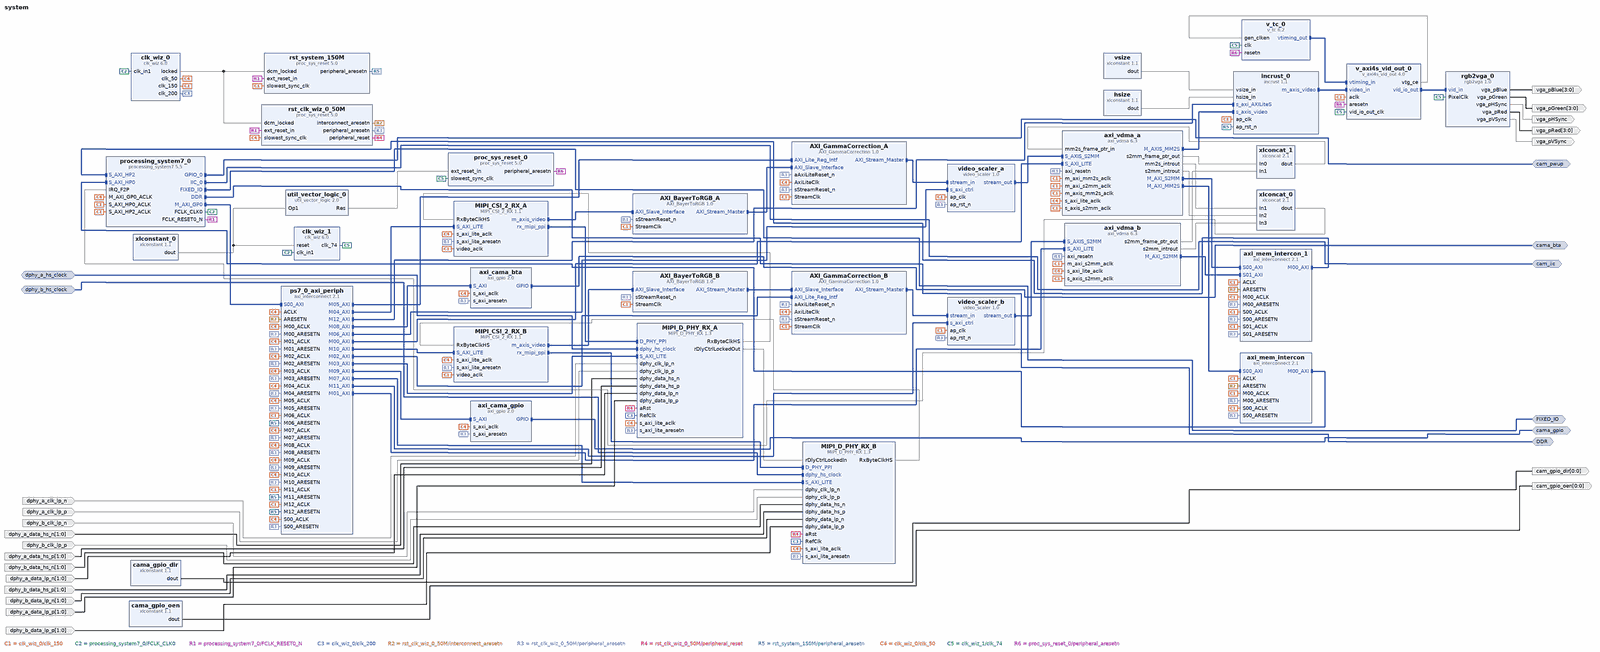
[diagram p0: block diagram of the top level, whole]
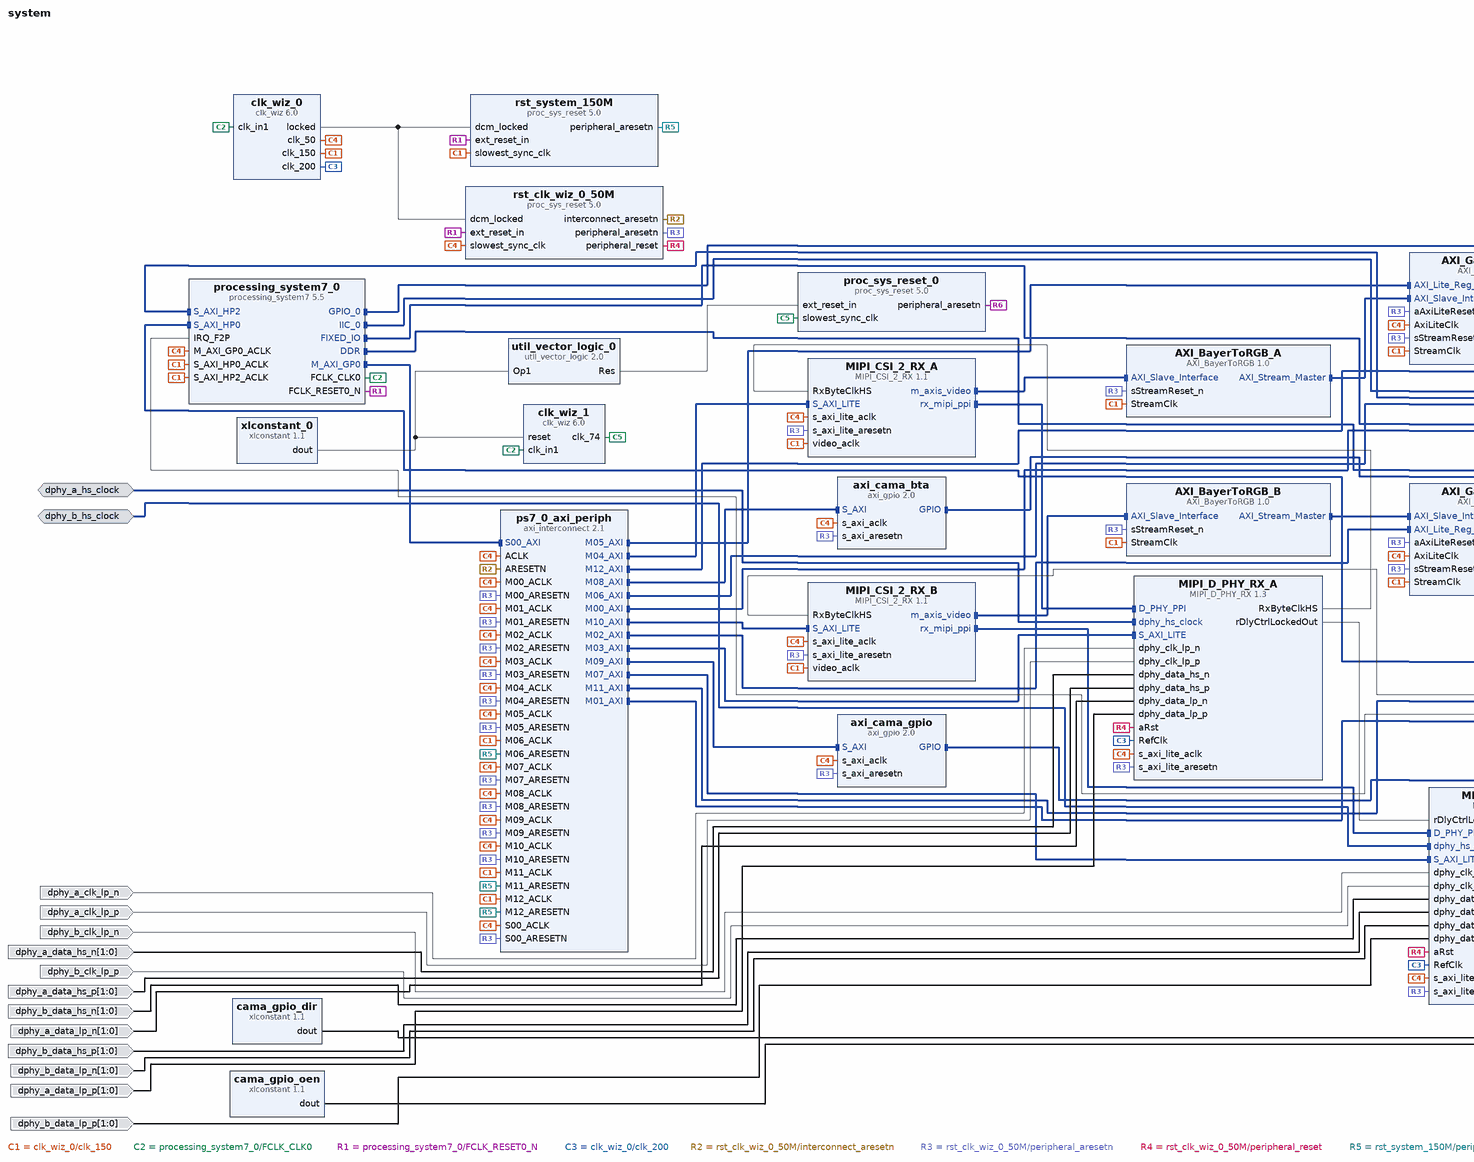
[diagram p1: block diagram of the top level, left part]
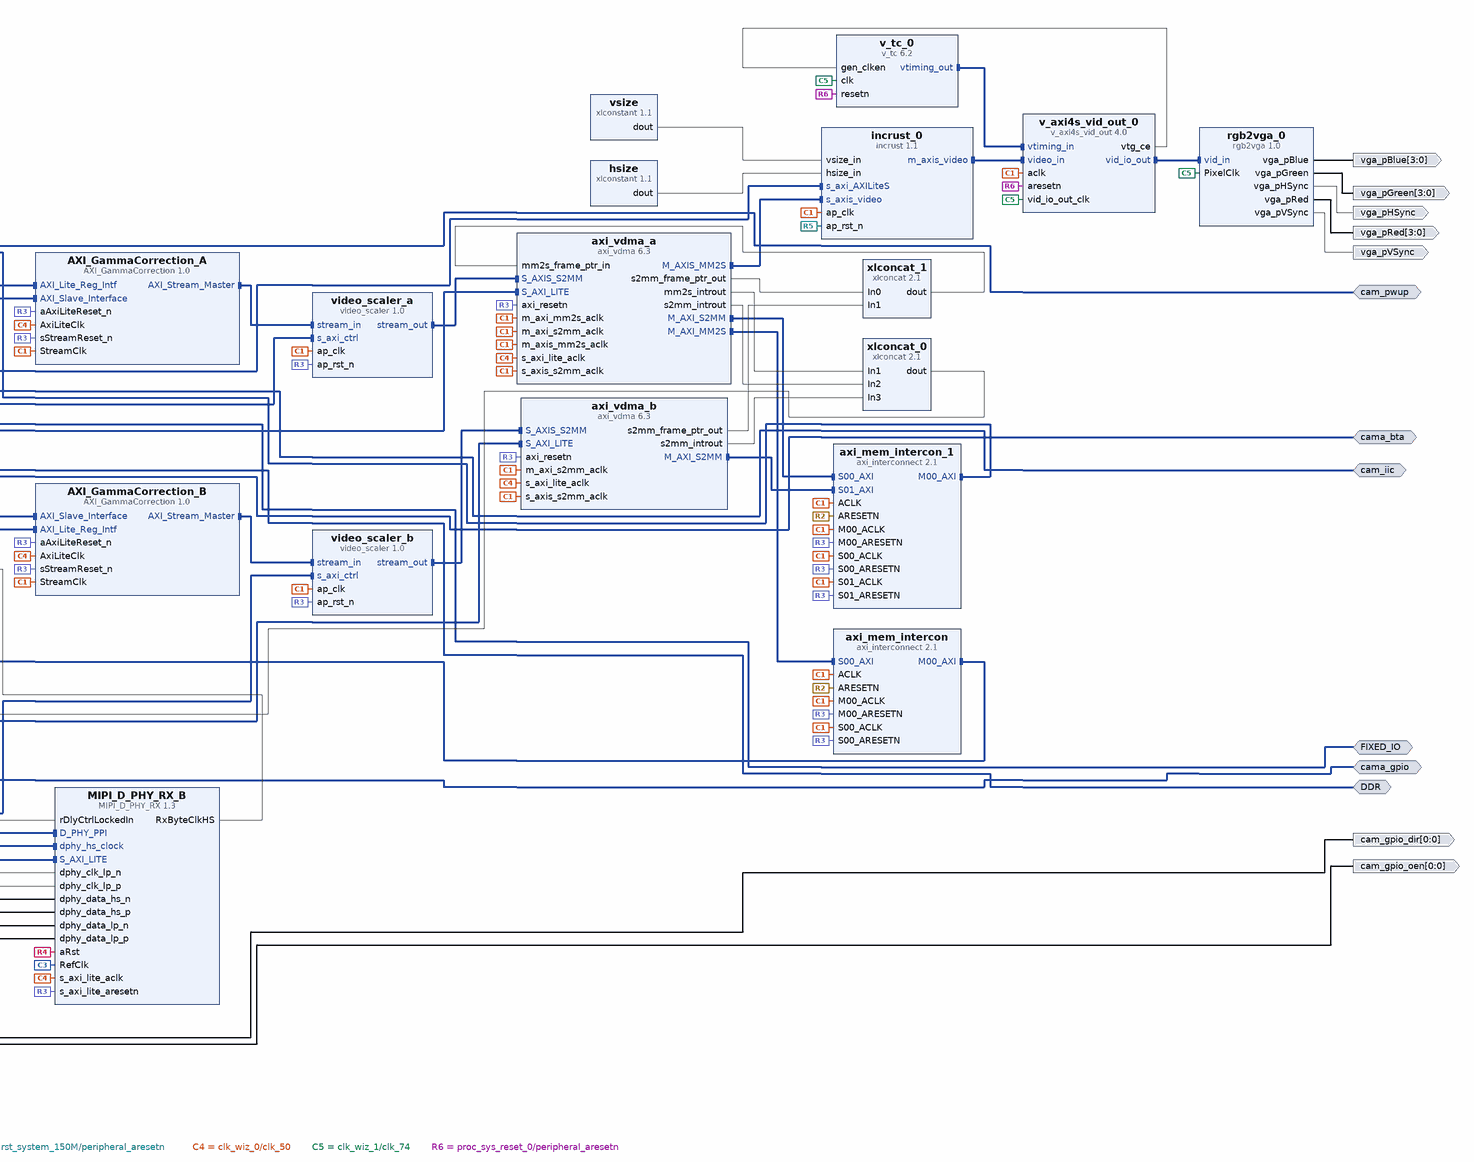
[diagram p2: block diagram of the top level, right part]
# Vivado block design system, xc7z020clg484-1, Vivado 2019.2
create_bd_design system

create_bd_intf_port -mode Master -vlnv xilinx.com:interface:ddrx_rtl:1.0 DDR
create_bd_intf_port -mode Master -vlnv xilinx.com:display_processing_system7:fixedio_rtl:1.0 FIXED_IO
create_bd_intf_port -mode Master -vlnv xilinx.com:interface:iic_rtl:1.0 cam_iic
create_bd_intf_port -mode Master -vlnv xilinx.com:interface:gpio_rtl:1.0 cam_pwup
create_bd_intf_port -mode Master -vlnv xilinx.com:interface:gpio_rtl:1.0 cama_bta
create_bd_intf_port -mode Master -vlnv xilinx.com:interface:gpio_rtl:1.0 cama_gpio
create_bd_intf_port -mode Slave -vlnv xilinx.com:interface:diff_clock_rtl:1.0 dphy_a_hs_clock
set_property -dict {CONFIG.FREQ_HZ 336000000} [get_bd_intf_ports dphy_a_hs_clock]
create_bd_intf_port -mode Slave -vlnv xilinx.com:interface:diff_clock_rtl:1.0 dphy_b_hs_clock
create_bd_port -dir O -from 0 -to 0 cam_gpio_dir
create_bd_port -dir O -from 0 -to 0 cam_gpio_oen
create_bd_port -dir I dphy_b_clk_lp_n
create_bd_port -dir I dphy_a_clk_lp_n
create_bd_port -dir I dphy_b_clk_lp_p
create_bd_port -dir I dphy_a_clk_lp_p
create_bd_port -dir I -from 1 -to 0 dphy_b_data_hs_n
create_bd_port -dir I -from 1 -to 0 dphy_a_data_hs_n
create_bd_port -dir I -from 1 -to 0 dphy_b_data_hs_p
create_bd_port -dir I -from 1 -to 0 dphy_a_data_hs_p
create_bd_port -dir I -from 1 -to 0 dphy_b_data_lp_n
create_bd_port -dir I -from 1 -to 0 dphy_a_data_lp_n
create_bd_port -dir I -from 1 -to 0 dphy_b_data_lp_p
create_bd_port -dir I -from 1 -to 0 dphy_a_data_lp_p
create_bd_port -dir O -from 3 -to 0 vga_pBlue
create_bd_port -dir O -from 3 -to 0 vga_pGreen
create_bd_port -dir O vga_pHSync
create_bd_port -dir O -from 3 -to 0 vga_pRed
create_bd_port -dir O vga_pVSync

create_bd_cell -type ip -vlnv digilentinc.com:user:AXI_BayerToRGB:1.0 AXI_BayerToRGB_A
create_bd_cell -type ip -vlnv digilentinc.com:user:AXI_BayerToRGB:1.0 AXI_BayerToRGB_B
create_bd_cell -type ip -vlnv digilentinc.com:user:AXI_GammaCorrection:1.0 AXI_GammaCorrection_A
create_bd_cell -type ip -vlnv digilentinc.com:user:AXI_GammaCorrection:1.0 AXI_GammaCorrection_B
create_bd_cell -type ip -vlnv xilinx.com:ip:processing_system7:5.5 processing_system7_0
set_property -dict [list \
  CONFIG.PCW_APU_PERIPHERAL_FREQMHZ 666.666667 \
  CONFIG.PCW_ENET0_ENET0_IO {MIO 16 .. 27} \
  CONFIG.PCW_ENET0_GRP_MDIO_ENABLE 1 \
  CONFIG.PCW_ENET0_GRP_MDIO_IO {MIO 52 .. 53} \
  CONFIG.PCW_ENET0_PERIPHERAL_ENABLE 1 \
  CONFIG.PCW_ENET_RESET_ENABLE 0 \
  CONFIG.PCW_FPGA0_PERIPHERAL_FREQMHZ 100.000000 \
  CONFIG.PCW_FPGA1_PERIPHERAL_FREQMHZ 150.000000 \
  CONFIG.PCW_GPIO_EMIO_GPIO_ENABLE 1 \
  CONFIG.PCW_GPIO_EMIO_GPIO_IO 2 \
  CONFIG.PCW_GPIO_EMIO_GPIO_WIDTH 2 \
  CONFIG.PCW_GPIO_MIO_GPIO_ENABLE 1 \
  CONFIG.PCW_GPIO_MIO_GPIO_IO MIO \
  CONFIG.PCW_I2C0_I2C0_IO EMIO \
  CONFIG.PCW_I2C0_PERIPHERAL_ENABLE 1 \
  CONFIG.PCW_I2C_PERIPHERAL_FREQMHZ 111.111115 \
  CONFIG.PCW_I2C_RESET_ENABLE 0 \
  CONFIG.PCW_IRQ_F2P_INTR 1 \
  CONFIG.PCW_PERIPHERAL_BOARD_PRESET part0 \
  CONFIG.PCW_PRESET_BANK1_VOLTAGE {LVCMOS 1.8V} \
  CONFIG.PCW_QSPI_GRP_SINGLE_SS_ENABLE 1 \
  CONFIG.PCW_QSPI_GRP_SINGLE_SS_IO {MIO 1 .. 6} \
  CONFIG.PCW_QSPI_PERIPHERAL_ENABLE 1 \
  CONFIG.PCW_QSPI_QSPI_IO {MIO 1 .. 6} \
  CONFIG.PCW_SD0_GRP_CD_ENABLE 1 \
  CONFIG.PCW_SD0_GRP_CD_IO {MIO 47} \
  CONFIG.PCW_SD0_GRP_WP_ENABLE 1 \
  CONFIG.PCW_SD0_GRP_WP_IO {MIO 46} \
  CONFIG.PCW_SD0_PERIPHERAL_ENABLE 1 \
  CONFIG.PCW_SD0_SD0_IO {MIO 40 .. 45} \
  CONFIG.PCW_SDIO_PERIPHERAL_FREQMHZ 100 \
  CONFIG.PCW_SINGLE_QSPI_DATA_MODE x4 \
  CONFIG.PCW_UART1_PERIPHERAL_ENABLE 1 \
  CONFIG.PCW_UART1_UART1_IO {MIO 48 .. 49} \
  CONFIG.PCW_UART_PERIPHERAL_FREQMHZ 50 \
  CONFIG.PCW_UIPARAM_DDR_FREQ_MHZ 533.333313 \
  CONFIG.PCW_UIPARAM_DDR_PARTNO {MT41J128M16 HA-15E} \
  CONFIG.PCW_USB0_PERIPHERAL_ENABLE 1 \
  CONFIG.PCW_USB0_RESET_ENABLE 0 \
  CONFIG.PCW_USB0_USB0_IO {MIO 28 .. 39} \
  CONFIG.PCW_USB_RESET_ENABLE 1 \
  CONFIG.PCW_USB_RESET_SELECT {Share reset pin} \
  CONFIG.PCW_USE_FABRIC_INTERRUPT 1 \
  CONFIG.PCW_USE_S_AXI_HP0 1 \
  CONFIG.PCW_USE_S_AXI_HP2 1 \
  CONFIG.preset ZedBoard \
] [get_bd_cells processing_system7_0]
# 516 more settings of processing_system7_0 are not shown: defaults, MIO pin electricals, DDR timing, and values the tool derives
create_bd_cell -type ip -vlnv digilentinc.com:ip:rgb2vga:1.0 rgb2vga_0
set_property -dict {CONFIG.kBlueDepth 4 CONFIG.kGreenDepth 4 CONFIG.kRedDepth 4} [get_bd_cells rgb2vga_0]
create_bd_cell -type ip -vlnv digilentinc.com:video:video_scaler:1.0 video_scaler_a
create_bd_cell -type ip -vlnv digilentinc.com:video:video_scaler:1.0 video_scaler_b
create_bd_cell -type ip -vlnv digilentinc.com:ip:MIPI_D_PHY_RX:1.3 MIPI_D_PHY_RX_A
set_property -dict [list \
  CONFIG.kDebug false \
  CONFIG.kGenerateAXIL true \
  CONFIG.kLPFromLane0 false \
  CONFIG.kNoOfDataLanes 2 \
] [get_bd_cells MIPI_D_PHY_RX_A]
create_bd_cell -type ip -vlnv digilentinc.com:ip:MIPI_D_PHY_RX:1.3 MIPI_D_PHY_RX_B
set_property -dict [list \
  CONFIG.kDebug false \
  CONFIG.kGenerateAXIL true \
  CONFIG.kLPFromLane0 false \
  CONFIG.kSharedLogic false \
] [get_bd_cells MIPI_D_PHY_RX_B]
create_bd_cell -type ip -vlnv xilinx.com:ip:axi_gpio:2.0 axi_cama_bta
set_property -dict {CONFIG.C_GPIO_WIDTH 4} [get_bd_cells axi_cama_bta]
create_bd_cell -type ip -vlnv xilinx.com:ip:axi_gpio:2.0 axi_cama_gpio
set_property -dict {CONFIG.C_GPIO_WIDTH 4} [get_bd_cells axi_cama_gpio]
create_bd_cell -type ip -vlnv xilinx.com:ip:axi_interconnect:2.1 axi_mem_intercon
set_property -dict {CONFIG.NUM_MI 1 CONFIG.SYNCHRONIZATION_STAGES 2} [get_bd_cells axi_mem_intercon]
create_bd_cell -type ip -vlnv xilinx.com:ip:axi_interconnect:2.1 axi_mem_intercon_1
set_property -dict {CONFIG.NUM_MI 1 CONFIG.NUM_SI 2 CONFIG.SYNCHRONIZATION_STAGES 2} [get_bd_cells axi_mem_intercon_1]
create_bd_cell -type ip -vlnv xilinx.com:ip:axi_vdma:6.3 axi_vdma_a
set_property -dict [list \
  CONFIG.c_enable_mm2s_frmstr_reg 1 \
  CONFIG.c_enable_s2mm_frmstr_reg 1 \
  CONFIG.c_enable_s2mm_sts_reg 1 \
  CONFIG.c_include_mm2s_dre 0 \
  CONFIG.c_include_s2mm 1 \
  CONFIG.c_m_axi_s2mm_data_width 64 \
  CONFIG.c_m_axis_mm2s_tdata_width 24 \
  CONFIG.c_mm2s_genlock_mode 1 \
  CONFIG.c_mm2s_genlock_num_masters 4 \
  CONFIG.c_mm2s_linebuffer_depth 1024 \
  CONFIG.c_num_fstores 5 \
  CONFIG.c_s2mm_genlock_mode 0 \
  CONFIG.c_s2mm_linebuffer_depth 1024 \
] [get_bd_cells axi_vdma_a]
create_bd_cell -type ip -vlnv xilinx.com:ip:axi_vdma:6.3 axi_vdma_b
set_property -dict [list \
  CONFIG.c_enable_s2mm_frmstr_reg 1 \
  CONFIG.c_enable_s2mm_sts_reg 1 \
  CONFIG.c_include_mm2s 0 \
  CONFIG.c_include_s2mm 1 \
  CONFIG.c_m_axi_s2mm_data_width 64 \
  CONFIG.c_num_fstores 5 \
  CONFIG.c_s2mm_genlock_mode 0 \
  CONFIG.c_s2mm_linebuffer_depth 1024 \
] [get_bd_cells axi_vdma_b]
create_bd_cell -type ip -vlnv xilinx.com:ip:xlconstant:1.1 cama_gpio_dir
create_bd_cell -type ip -vlnv xilinx.com:ip:xlconstant:1.1 cama_gpio_oen
set_property -dict {CONFIG.CONST_VAL 0} [get_bd_cells cama_gpio_oen]
create_bd_cell -type ip -vlnv xilinx.com:ip:clk_wiz:6.0 clk_wiz_0
set_property -dict [list \
  CONFIG.CLKOUT1_DRIVES BUFG \
  CONFIG.CLKOUT1_JITTER 174.353 \
  CONFIG.CLKOUT1_PHASE_ERROR 132.063 \
  CONFIG.CLKOUT1_REQUESTED_OUT_FREQ 50 \
  CONFIG.CLKOUT2_DRIVES BUFG \
  CONFIG.CLKOUT2_JITTER 139.594 \
  CONFIG.CLKOUT2_PHASE_ERROR 132.063 \
  CONFIG.CLKOUT2_REQUESTED_OUT_FREQ 150 \
  CONFIG.CLKOUT2_USED true \
  CONFIG.CLKOUT3_DRIVES BUFG \
  CONFIG.CLKOUT3_JITTER 132.221 \
  CONFIG.CLKOUT3_PHASE_ERROR 132.063 \
  CONFIG.CLKOUT3_REQUESTED_OUT_FREQ 200 \
  CONFIG.CLKOUT3_USED true \
  CONFIG.CLKOUT4_DRIVES BUFG \
  CONFIG.CLKOUT5_DRIVES BUFG \
  CONFIG.CLKOUT6_DRIVES BUFG \
  CONFIG.CLKOUT7_DRIVES BUFG \
  CONFIG.CLK_OUT1_PORT clk_50 \
  CONFIG.CLK_OUT2_PORT clk_150 \
  CONFIG.CLK_OUT3_PORT clk_200 \
  CONFIG.MMCM_CLKFBOUT_MULT_F 6.000 \
  CONFIG.MMCM_CLKIN1_PERIOD 10.0 \
  CONFIG.MMCM_CLKIN2_PERIOD 10.0 \
  CONFIG.MMCM_CLKOUT0_DIVIDE_F 12.000 \
  CONFIG.MMCM_CLKOUT1_DIVIDE 4 \
  CONFIG.MMCM_CLKOUT2_DIVIDE 3 \
  CONFIG.MMCM_DIVCLK_DIVIDE 1 \
  CONFIG.NUM_OUT_CLKS 3 \
  CONFIG.PRIM_SOURCE Global_buffer \
  CONFIG.RESET_PORT reset \
  CONFIG.RESET_TYPE ACTIVE_HIGH \
  CONFIG.SECONDARY_SOURCE Single_ended_clock_capable_pin \
  CONFIG.USE_PHASE_ALIGNMENT false \
  CONFIG.USE_RESET false \
] [get_bd_cells clk_wiz_0]
create_bd_cell -type ip -vlnv xilinx.com:ip:axi_interconnect:2.1 ps7_0_axi_periph
set_property -dict [list \
  CONFIG.M06_HAS_REGSLICE 0 \
  CONFIG.M16_HAS_REGSLICE 0 \
  CONFIG.M17_HAS_REGSLICE 0 \
  CONFIG.M18_HAS_REGSLICE 0 \
  CONFIG.NUM_MI 13 \
  CONFIG.S00_HAS_REGSLICE 4 \
  CONFIG.SYNCHRONIZATION_STAGES 2 \
] [get_bd_cells ps7_0_axi_periph]
create_bd_cell -type ip -vlnv xilinx.com:ip:proc_sys_reset:5.0 rst_clk_wiz_0_50M
create_bd_cell -type ip -vlnv xilinx.com:ip:proc_sys_reset:5.0 rst_system_150M
create_bd_cell -type ip -vlnv xilinx.com:ip:xlconcat:2.1 xlconcat_0
set_property -dict {CONFIG.NUM_PORTS 4 CONFIG.dout_width 4} [get_bd_cells xlconcat_0]
create_bd_cell -type ip -vlnv xilinx.com:ip:xlconcat:2.1 xlconcat_1
set_property -dict {CONFIG.NUM_PORTS 2 CONFIG.dout_width 12} [get_bd_cells xlconcat_1]
create_bd_cell -type ip -vlnv digilentinc.com:ip:MIPI_CSI_2_RX:1.1 MIPI_CSI_2_RX_A
set_property -dict {CONFIG.kDebug false CONFIG.kGenerateAXIL true} [get_bd_cells MIPI_CSI_2_RX_A]
create_bd_cell -type ip -vlnv digilentinc.com:ip:MIPI_CSI_2_RX:1.1 MIPI_CSI_2_RX_B
set_property -dict {CONFIG.kGenerateAXIL true} [get_bd_cells MIPI_CSI_2_RX_B]
create_bd_cell -type ip -vlnv xilinx.com:ip:clk_wiz:6.0 clk_wiz_1
set_property -dict [list \
  CONFIG.CLKOUT1_JITTER 298.245 \
  CONFIG.CLKOUT1_PHASE_ERROR 322.999 \
  CONFIG.CLKOUT1_REQUESTED_OUT_FREQ 148.5 \
  CONFIG.CLKOUT2_JITTER 298.245 \
  CONFIG.CLKOUT2_PHASE_ERROR 322.999 \
  CONFIG.CLKOUT2_REQUESTED_OUT_FREQ 148.5 \
  CONFIG.CLKOUT2_USED true \
  CONFIG.CLK_OUT1_PORT clk_74 \
  CONFIG.CLK_OUT2_PORT clk_148 \
  CONFIG.MMCM_CLKFBOUT_MULT_F 37.125 \
  CONFIG.MMCM_CLKOUT0_DIVIDE_F 5.000 \
  CONFIG.MMCM_CLKOUT1_DIVIDE 5 \
  CONFIG.MMCM_DIVCLK_DIVIDE 5 \
  CONFIG.NUM_OUT_CLKS 2 \
] [get_bd_cells clk_wiz_1]
create_bd_cell -type ip -vlnv xilinx.com:ip:proc_sys_reset:5.0 proc_sys_reset_0
create_bd_cell -type ip -vlnv xilinx.com:ip:v_tc:6.2 v_tc_0
set_property -dict {CONFIG.HAS_AXI4_LITE false CONFIG.VIDEO_MODE 1080p CONFIG.enable_detection false} [get_bd_cells v_tc_0]
create_bd_cell -type ip -vlnv xilinx.com:ip:v_axi4s_vid_out:4.0 v_axi4s_vid_out_0
set_property -dict {CONFIG.C_HAS_ASYNC_CLK 1} [get_bd_cells v_axi4s_vid_out_0]
create_bd_cell -type ip -vlnv xilinx.com:ip:xlconstant:1.1 xlconstant_0
set_property -dict {CONFIG.CONST_VAL 0} [get_bd_cells xlconstant_0]
create_bd_cell -type ip -vlnv xilinx.com:ip:util_vector_logic:2.0 util_vector_logic_0
set_property -dict {CONFIG.C_OPERATION not CONFIG.C_SIZE 1} [get_bd_cells util_vector_logic_0]
create_bd_cell -type ip -vlnv xilinx.com:ip:xlconstant:1.1 hsize
set_property -dict {CONFIG.CONST_VAL 1920 CONFIG.CONST_WIDTH 32} [get_bd_cells hsize]
create_bd_cell -type ip -vlnv xilinx.com:ip:xlconstant:1.1 vsize
set_property -dict {CONFIG.CONST_VAL 1080 CONFIG.CONST_WIDTH 32} [get_bd_cells vsize]
create_bd_cell -type ip -vlnv xilinx.com:hls:incrust:1.1 incrust_0

# ---- connections ----

connect_bd_intf_net [get_bd_intf_ports cam_pwup] [get_bd_intf_pins processing_system7_0/GPIO_0]
connect_bd_intf_net [get_bd_intf_pins axi_vdma_a/S_AXI_LITE] [get_bd_intf_pins ps7_0_axi_periph/M00_AXI]
connect_bd_intf_net -intf_net axi_vdma_0_M_AXI_S2MM [get_bd_intf_pins axi_mem_intercon_1/S00_AXI] [get_bd_intf_pins axi_vdma_a/M_AXI_S2MM]
connect_bd_intf_net [get_bd_intf_pins AXI_GammaCorrection_B/AXI_Stream_Master] [get_bd_intf_pins video_scaler_b/stream_in]
connect_bd_intf_net [get_bd_intf_pins axi_vdma_b/S_AXIS_S2MM] [get_bd_intf_pins video_scaler_b/stream_out]
connect_bd_intf_net [get_bd_intf_pins axi_vdma_a/S_AXIS_S2MM] [get_bd_intf_pins video_scaler_a/stream_out]
connect_bd_intf_net -intf_net AXI_BayerToRGB_1_AXI_Stream_Master [get_bd_intf_pins AXI_BayerToRGB_A/AXI_Stream_Master] [get_bd_intf_pins AXI_GammaCorrection_A/AXI_Slave_Interface]
connect_bd_intf_net [get_bd_intf_pins incrust_0/m_axis_video] [get_bd_intf_pins v_axi4s_vid_out_0/video_in]
connect_bd_intf_net [get_bd_intf_ports dphy_a_hs_clock] [get_bd_intf_pins MIPI_D_PHY_RX_A/dphy_hs_clock]
connect_bd_intf_net [get_bd_intf_ports cama_bta] [get_bd_intf_pins axi_cama_bta/GPIO]
connect_bd_intf_net -intf_net MIPI_D_PHY_RX_1_D_PHY_PPI [get_bd_intf_pins MIPI_CSI_2_RX_B/rx_mipi_ppi] [get_bd_intf_pins MIPI_D_PHY_RX_B/D_PHY_PPI]
connect_bd_intf_net [get_bd_intf_pins ps7_0_axi_periph/M06_AXI] [get_bd_intf_pins video_scaler_a/s_axi_ctrl]
connect_bd_intf_net [get_bd_intf_ports cam_iic] [get_bd_intf_pins processing_system7_0/IIC_0]
connect_bd_intf_net [get_bd_intf_ports FIXED_IO] [get_bd_intf_pins processing_system7_0/FIXED_IO]
connect_bd_intf_net [get_bd_intf_pins MIPI_CSI_2_RX_A/S_AXI_LITE] [get_bd_intf_pins ps7_0_axi_periph/M04_AXI]
connect_bd_intf_net [get_bd_intf_pins AXI_GammaCorrection_A/AXI_Stream_Master] [get_bd_intf_pins video_scaler_a/stream_in]
connect_bd_intf_net [get_bd_intf_pins incrust_0/s_axis_video] [get_bd_intf_pins axi_vdma_a/M_AXIS_MM2S]
connect_bd_intf_net [get_bd_intf_pins axi_mem_intercon_1/M00_AXI] [get_bd_intf_pins processing_system7_0/S_AXI_HP2]
connect_bd_intf_net [get_bd_intf_ports cama_gpio] [get_bd_intf_pins axi_cama_gpio/GPIO]
connect_bd_intf_net -intf_net axi_vdma_2_M_AXI_S2MM [get_bd_intf_pins axi_mem_intercon_1/S01_AXI] [get_bd_intf_pins axi_vdma_b/M_AXI_S2MM]
connect_bd_intf_net [get_bd_intf_ports DDR] [get_bd_intf_pins processing_system7_0/DDR]
connect_bd_intf_net [get_bd_intf_pins ps7_0_axi_periph/M12_AXI] [get_bd_intf_pins incrust_0/s_axi_AXILiteS]
connect_bd_intf_net [get_bd_intf_pins AXI_GammaCorrection_A/AXI_Lite_Reg_Intf] [get_bd_intf_pins ps7_0_axi_periph/M05_AXI]
connect_bd_intf_net [get_bd_intf_pins v_axi4s_vid_out_0/vid_io_out] [get_bd_intf_pins rgb2vga_0/vid_in]
connect_bd_intf_net [get_bd_intf_pins AXI_GammaCorrection_B/AXI_Lite_Reg_Intf] [get_bd_intf_pins ps7_0_axi_periph/M02_AXI]
connect_bd_intf_net [get_bd_intf_pins axi_vdma_b/S_AXI_LITE] [get_bd_intf_pins ps7_0_axi_periph/M01_AXI]
connect_bd_intf_net [get_bd_intf_pins ps7_0_axi_periph/M09_AXI] [get_bd_intf_pins axi_cama_gpio/S_AXI]
connect_bd_intf_net -intf_net MIPI_D_PHY_RX_0_D_PHY_PPI [get_bd_intf_pins MIPI_CSI_2_RX_A/rx_mipi_ppi] [get_bd_intf_pins MIPI_D_PHY_RX_A/D_PHY_PPI]
connect_bd_intf_net -intf_net MIPI_CSI_2_RX_1_m_axis_video [get_bd_intf_pins AXI_BayerToRGB_B/AXI_Slave_Interface] [get_bd_intf_pins MIPI_CSI_2_RX_B/m_axis_video]
connect_bd_intf_net [get_bd_intf_pins MIPI_CSI_2_RX_B/S_AXI_LITE] [get_bd_intf_pins ps7_0_axi_periph/M10_AXI]
connect_bd_intf_net -intf_net AXI_BayerToRGB_0_AXI_Stream_Master [get_bd_intf_pins AXI_BayerToRGB_B/AXI_Stream_Master] [get_bd_intf_pins AXI_GammaCorrection_B/AXI_Slave_Interface]
connect_bd_intf_net [get_bd_intf_pins axi_mem_intercon/M00_AXI] [get_bd_intf_pins processing_system7_0/S_AXI_HP0]
connect_bd_intf_net -intf_net dphy_hs_clock_0_1 [get_bd_intf_ports dphy_b_hs_clock] [get_bd_intf_pins MIPI_D_PHY_RX_B/dphy_hs_clock]
connect_bd_intf_net [get_bd_intf_pins v_tc_0/vtiming_out] [get_bd_intf_pins v_axi4s_vid_out_0/vtiming_in]
connect_bd_intf_net -intf_net axi_vdma_0_M_AXI_MM2S [get_bd_intf_pins axi_mem_intercon/S00_AXI] [get_bd_intf_pins axi_vdma_a/M_AXI_MM2S]
connect_bd_intf_net [get_bd_intf_pins ps7_0_axi_periph/M08_AXI] [get_bd_intf_pins axi_cama_bta/S_AXI]
connect_bd_intf_net [get_bd_intf_pins MIPI_D_PHY_RX_B/S_AXI_LITE] [get_bd_intf_pins ps7_0_axi_periph/M07_AXI]
connect_bd_intf_net [get_bd_intf_pins processing_system7_0/M_AXI_GP0] [get_bd_intf_pins ps7_0_axi_periph/S00_AXI]
connect_bd_intf_net [get_bd_intf_pins MIPI_D_PHY_RX_A/S_AXI_LITE] [get_bd_intf_pins ps7_0_axi_periph/M03_AXI]
connect_bd_intf_net [get_bd_intf_pins video_scaler_b/s_axi_ctrl] [get_bd_intf_pins ps7_0_axi_periph/M11_AXI]
connect_bd_intf_net -intf_net MIPI_CSI_2_RX_0_m_axis_video [get_bd_intf_pins AXI_BayerToRGB_A/AXI_Slave_Interface] [get_bd_intf_pins MIPI_CSI_2_RX_A/m_axis_video]
connect_bd_net -net MIPI_D_PHY_RX_0_RxByteClkHS [get_bd_pins MIPI_D_PHY_RX_A/RxByteClkHS] [get_bd_pins MIPI_CSI_2_RX_A/RxByteClkHS]
connect_bd_net -net MIPI_D_PHY_RX_0_rDlyCtrlLockedOut [get_bd_pins MIPI_D_PHY_RX_A/rDlyCtrlLockedOut] [get_bd_pins MIPI_D_PHY_RX_B/rDlyCtrlLockedIn]
connect_bd_net -net MIPI_D_PHY_RX_1_RxByteClkHS [get_bd_pins MIPI_D_PHY_RX_B/RxByteClkHS] [get_bd_pins MIPI_CSI_2_RX_B/RxByteClkHS]
connect_bd_net -net axi_vdma_0_mm2s_introut [get_bd_pins axi_vdma_a/mm2s_introut] [get_bd_pins xlconcat_0/In1]
connect_bd_net -net axi_vdma_0_s2mm_introut [get_bd_pins axi_vdma_a/s2mm_introut] [get_bd_pins xlconcat_0/In2]
connect_bd_net -net axi_vdma_2_s2mm_introut [get_bd_pins axi_vdma_b/s2mm_introut] [get_bd_pins xlconcat_0/In3]
connect_bd_net [get_bd_pins axi_vdma_a/s2mm_frame_ptr_out] [get_bd_pins xlconcat_1/In0]
connect_bd_net [get_bd_pins axi_vdma_b/s2mm_frame_ptr_out] [get_bd_pins xlconcat_1/In1]
connect_bd_net [get_bd_pins cama_gpio_dir/dout] [get_bd_ports cam_gpio_dir]
connect_bd_net [get_bd_pins cama_gpio_oen/dout] [get_bd_ports cam_gpio_oen]
connect_bd_net [get_bd_pins clk_wiz_0/locked] [get_bd_pins rst_clk_wiz_0_50M/dcm_locked] [get_bd_pins rst_system_150M/dcm_locked]
connect_bd_net -net dphy_clk_lp_n_0_1 [get_bd_ports dphy_b_clk_lp_n] [get_bd_pins MIPI_D_PHY_RX_B/dphy_clk_lp_n]
connect_bd_net -net dphy_clk_lp_n_1 [get_bd_ports dphy_a_clk_lp_n] [get_bd_pins MIPI_D_PHY_RX_A/dphy_clk_lp_n]
connect_bd_net -net dphy_clk_lp_p_0_1 [get_bd_ports dphy_b_clk_lp_p] [get_bd_pins MIPI_D_PHY_RX_B/dphy_clk_lp_p]
connect_bd_net -net dphy_clk_lp_p_1 [get_bd_ports dphy_a_clk_lp_p] [get_bd_pins MIPI_D_PHY_RX_A/dphy_clk_lp_p]
connect_bd_net -net dphy_data_hs_n_0_1 [get_bd_ports dphy_b_data_hs_n] [get_bd_pins MIPI_D_PHY_RX_B/dphy_data_hs_n]
connect_bd_net -net dphy_data_hs_n_1 [get_bd_ports dphy_a_data_hs_n] [get_bd_pins MIPI_D_PHY_RX_A/dphy_data_hs_n]
connect_bd_net -net dphy_data_hs_p_0_1 [get_bd_ports dphy_b_data_hs_p] [get_bd_pins MIPI_D_PHY_RX_B/dphy_data_hs_p]
connect_bd_net -net dphy_data_hs_p_1 [get_bd_ports dphy_a_data_hs_p] [get_bd_pins MIPI_D_PHY_RX_A/dphy_data_hs_p]
connect_bd_net -net dphy_data_lp_n_0_1 [get_bd_ports dphy_b_data_lp_n] [get_bd_pins MIPI_D_PHY_RX_B/dphy_data_lp_n]
connect_bd_net -net dphy_data_lp_n_1 [get_bd_ports dphy_a_data_lp_n] [get_bd_pins MIPI_D_PHY_RX_A/dphy_data_lp_n]
connect_bd_net -net dphy_data_lp_p_0_1 [get_bd_ports dphy_b_data_lp_p] [get_bd_pins MIPI_D_PHY_RX_B/dphy_data_lp_p]
connect_bd_net -net dphy_data_lp_p_1 [get_bd_ports dphy_a_data_lp_p] [get_bd_pins MIPI_D_PHY_RX_A/dphy_data_lp_p]
connect_bd_net -net mm_clk_150 [get_bd_pins clk_wiz_0/clk_150] \
  [get_bd_pins AXI_BayerToRGB_A/StreamClk] [get_bd_pins AXI_BayerToRGB_B/StreamClk] \
  [get_bd_pins AXI_GammaCorrection_A/StreamClk] [get_bd_pins AXI_GammaCorrection_B/StreamClk] \
  [get_bd_pins processing_system7_0/S_AXI_HP0_ACLK] [get_bd_pins processing_system7_0/S_AXI_HP2_ACLK] \
  [get_bd_pins video_scaler_a/ap_clk] [get_bd_pins video_scaler_b/ap_clk] [get_bd_pins axi_mem_intercon/ACLK] \
  [get_bd_pins axi_mem_intercon/S00_ACLK] [get_bd_pins axi_mem_intercon/M00_ACLK] [get_bd_pins axi_mem_intercon_1/ACLK] \
  [get_bd_pins axi_mem_intercon_1/S00_ACLK] [get_bd_pins axi_mem_intercon_1/M00_ACLK] \
  [get_bd_pins axi_mem_intercon_1/S01_ACLK] [get_bd_pins axi_vdma_a/m_axi_mm2s_aclk] \
  [get_bd_pins axi_vdma_a/m_axis_mm2s_aclk] [get_bd_pins axi_vdma_a/m_axi_s2mm_aclk] \
  [get_bd_pins axi_vdma_a/s_axis_s2mm_aclk] [get_bd_pins axi_vdma_b/m_axi_s2mm_aclk] \
  [get_bd_pins axi_vdma_b/s_axis_s2mm_aclk] [get_bd_pins ps7_0_axi_periph/M06_ACLK] \
  [get_bd_pins rst_system_150M/slowest_sync_clk] [get_bd_pins MIPI_CSI_2_RX_A/video_aclk] \
  [get_bd_pins MIPI_CSI_2_RX_B/video_aclk] [get_bd_pins v_axi4s_vid_out_0/aclk] [get_bd_pins ps7_0_axi_periph/M11_ACLK] \
  [get_bd_pins ps7_0_axi_periph/M12_ACLK] [get_bd_pins incrust_0/ap_clk]
connect_bd_net [get_bd_pins processing_system7_0/FCLK_CLK0] [get_bd_pins clk_wiz_0/clk_in1] [get_bd_pins clk_wiz_1/clk_in1]
connect_bd_net [get_bd_pins processing_system7_0/FCLK_RESET0_N] \
  [get_bd_pins rst_clk_wiz_0_50M/ext_reset_in] [get_bd_pins rst_system_150M/ext_reset_in]
connect_bd_net -net ref_clk_200 [get_bd_pins clk_wiz_0/clk_200] [get_bd_pins MIPI_D_PHY_RX_A/RefClk] [get_bd_pins MIPI_D_PHY_RX_B/RefClk]
connect_bd_net [get_bd_pins rgb2vga_0/vga_pBlue] [get_bd_ports vga_pBlue]
connect_bd_net [get_bd_pins rgb2vga_0/vga_pGreen] [get_bd_ports vga_pGreen]
connect_bd_net [get_bd_pins rgb2vga_0/vga_pHSync] [get_bd_ports vga_pHSync]
connect_bd_net [get_bd_pins rgb2vga_0/vga_pRed] [get_bd_ports vga_pRed]
connect_bd_net [get_bd_pins rgb2vga_0/vga_pVSync] [get_bd_ports vga_pVSync]
connect_bd_net [get_bd_pins rst_clk_wiz_0_50M/interconnect_aresetn] \
  [get_bd_pins axi_mem_intercon/ARESETN] [get_bd_pins axi_mem_intercon_1/ARESETN] [get_bd_pins ps7_0_axi_periph/ARESETN]
connect_bd_net [get_bd_pins rst_clk_wiz_0_50M/peripheral_aresetn] \
  [get_bd_pins AXI_BayerToRGB_A/sStreamReset_n] [get_bd_pins AXI_BayerToRGB_B/sStreamReset_n] \
  [get_bd_pins AXI_GammaCorrection_A/aAxiLiteReset_n] [get_bd_pins AXI_GammaCorrection_A/sStreamReset_n] \
  [get_bd_pins AXI_GammaCorrection_B/aAxiLiteReset_n] [get_bd_pins AXI_GammaCorrection_B/sStreamReset_n] \
  [get_bd_pins video_scaler_a/ap_rst_n] [get_bd_pins video_scaler_b/ap_rst_n] \
  [get_bd_pins MIPI_D_PHY_RX_A/s_axi_lite_aresetn] [get_bd_pins MIPI_D_PHY_RX_B/s_axi_lite_aresetn] \
  [get_bd_pins axi_cama_bta/s_axi_aresetn] [get_bd_pins axi_cama_gpio/s_axi_aresetn] \
  [get_bd_pins axi_mem_intercon/S00_ARESETN] [get_bd_pins axi_mem_intercon/M00_ARESETN] \
  [get_bd_pins axi_mem_intercon_1/S00_ARESETN] [get_bd_pins axi_mem_intercon_1/M00_ARESETN] \
  [get_bd_pins axi_mem_intercon_1/S01_ARESETN] [get_bd_pins axi_vdma_a/axi_resetn] [get_bd_pins axi_vdma_b/axi_resetn] \
  [get_bd_pins ps7_0_axi_periph/S00_ARESETN] [get_bd_pins ps7_0_axi_periph/M00_ARESETN] \
  [get_bd_pins ps7_0_axi_periph/M01_ARESETN] [get_bd_pins ps7_0_axi_periph/M02_ARESETN] \
  [get_bd_pins ps7_0_axi_periph/M03_ARESETN] [get_bd_pins ps7_0_axi_periph/M04_ARESETN] \
  [get_bd_pins ps7_0_axi_periph/M05_ARESETN] [get_bd_pins ps7_0_axi_periph/M07_ARESETN] \
  [get_bd_pins ps7_0_axi_periph/M08_ARESETN] [get_bd_pins ps7_0_axi_periph/M09_ARESETN] \
  [get_bd_pins ps7_0_axi_periph/M10_ARESETN] [get_bd_pins MIPI_CSI_2_RX_A/s_axi_lite_aresetn] \
  [get_bd_pins MIPI_CSI_2_RX_B/s_axi_lite_aresetn]
connect_bd_net [get_bd_pins rst_clk_wiz_0_50M/peripheral_reset] [get_bd_pins MIPI_D_PHY_RX_A/aRst] [get_bd_pins MIPI_D_PHY_RX_B/aRst]
connect_bd_net [get_bd_pins rst_system_150M/peripheral_aresetn] \
  [get_bd_pins ps7_0_axi_periph/M06_ARESETN] [get_bd_pins ps7_0_axi_periph/M11_ARESETN] \
  [get_bd_pins ps7_0_axi_periph/M12_ARESETN] [get_bd_pins incrust_0/ap_rst_n]
connect_bd_net -net s_axil_clk_50 [get_bd_pins clk_wiz_0/clk_50] \
  [get_bd_pins AXI_GammaCorrection_A/AxiLiteClk] [get_bd_pins AXI_GammaCorrection_B/AxiLiteClk] \
  [get_bd_pins processing_system7_0/M_AXI_GP0_ACLK] [get_bd_pins MIPI_D_PHY_RX_A/s_axi_lite_aclk] \
  [get_bd_pins MIPI_D_PHY_RX_B/s_axi_lite_aclk] [get_bd_pins axi_cama_bta/s_axi_aclk] [get_bd_pins axi_cama_gpio/s_axi_aclk] \
  [get_bd_pins axi_vdma_a/s_axi_lite_aclk] [get_bd_pins axi_vdma_b/s_axi_lite_aclk] [get_bd_pins ps7_0_axi_periph/ACLK] \
  [get_bd_pins ps7_0_axi_periph/S00_ACLK] [get_bd_pins ps7_0_axi_periph/M00_ACLK] [get_bd_pins ps7_0_axi_periph/M01_ACLK] \
  [get_bd_pins ps7_0_axi_periph/M02_ACLK] [get_bd_pins ps7_0_axi_periph/M03_ACLK] [get_bd_pins ps7_0_axi_periph/M04_ACLK] \
  [get_bd_pins ps7_0_axi_periph/M05_ACLK] [get_bd_pins ps7_0_axi_periph/M07_ACLK] [get_bd_pins ps7_0_axi_periph/M08_ACLK] \
  [get_bd_pins ps7_0_axi_periph/M09_ACLK] [get_bd_pins ps7_0_axi_periph/M10_ACLK] \
  [get_bd_pins rst_clk_wiz_0_50M/slowest_sync_clk] [get_bd_pins MIPI_CSI_2_RX_A/s_axi_lite_aclk] \
  [get_bd_pins MIPI_CSI_2_RX_B/s_axi_lite_aclk]
connect_bd_net [get_bd_pins xlconcat_0/dout] [get_bd_pins processing_system7_0/IRQ_F2P]
connect_bd_net [get_bd_pins xlconcat_1/dout] [get_bd_pins axi_vdma_a/mm2s_frame_ptr_in]
connect_bd_net [get_bd_pins v_axi4s_vid_out_0/vtg_ce] [get_bd_pins v_tc_0/gen_clken]
connect_bd_net [get_bd_pins xlconstant_0/dout] [get_bd_pins clk_wiz_1/reset] [get_bd_pins util_vector_logic_0/Op1]
connect_bd_net [get_bd_pins util_vector_logic_0/Res] [get_bd_pins proc_sys_reset_0/ext_reset_in]
connect_bd_net [get_bd_pins clk_wiz_1/clk_74] \
  [get_bd_pins proc_sys_reset_0/slowest_sync_clk] [get_bd_pins v_tc_0/clk] [get_bd_pins v_axi4s_vid_out_0/vid_io_out_clk] \
  [get_bd_pins rgb2vga_0/PixelClk]
connect_bd_net [get_bd_pins proc_sys_reset_0/peripheral_aresetn] [get_bd_pins v_tc_0/resetn] [get_bd_pins v_axi4s_vid_out_0/aresetn]
connect_bd_net [get_bd_pins vsize/dout] [get_bd_pins incrust_0/vsize_in]
connect_bd_net [get_bd_pins hsize/dout] [get_bd_pins incrust_0/hsize_in]

# ---- address map ----
assign_bd_address -offset 0x00000000 -range 512M -target_address_space [get_bd_addr_spaces axi_vdma_a/Data_MM2S] [get_bd_addr_segs processing_system7_0/S_AXI_HP0/HP0_DDR_LOWOCM]
assign_bd_address -offset 0x00000000 -range 512M -target_address_space [get_bd_addr_spaces axi_vdma_a/Data_S2MM] [get_bd_addr_segs processing_system7_0/S_AXI_HP2/HP2_DDR_LOWOCM]
assign_bd_address -offset 0x00000000 -range 512M -target_address_space [get_bd_addr_spaces axi_vdma_b/Data_S2MM] [get_bd_addr_segs processing_system7_0/S_AXI_HP2/HP2_DDR_LOWOCM]
assign_bd_address -offset 0x41200000 -range 64K -target_address_space [get_bd_addr_spaces processing_system7_0/Data] [get_bd_addr_segs axi_cama_bta/S_AXI/Reg]
assign_bd_address -offset 0x41210000 -range 64K -target_address_space [get_bd_addr_spaces processing_system7_0/Data] [get_bd_addr_segs axi_cama_gpio/S_AXI/Reg]
assign_bd_address -offset 0x43000000 -range 64K -target_address_space [get_bd_addr_spaces processing_system7_0/Data] [get_bd_addr_segs axi_vdma_a/S_AXI_LITE/Reg]
assign_bd_address -offset 0x43010000 -range 64K -target_address_space [get_bd_addr_spaces processing_system7_0/Data] [get_bd_addr_segs axi_vdma_b/S_AXI_LITE/Reg]
assign_bd_address -offset 0x43C00000 -range 64K -target_address_space [get_bd_addr_spaces processing_system7_0/Data] [get_bd_addr_segs AXI_GammaCorrection_B/AXI_Lite_Reg_Intf/Reg]
assign_bd_address -offset 0x43C10000 -range 64K -target_address_space [get_bd_addr_spaces processing_system7_0/Data] [get_bd_addr_segs video_scaler_b/s_axi_ctrl/Reg]
assign_bd_address -offset 0x43C20000 -range 64K -target_address_space [get_bd_addr_spaces processing_system7_0/Data] [get_bd_addr_segs MIPI_D_PHY_RX_A/S_AXI_LITE/S_AXI_LITE_reg]
assign_bd_address -offset 0x43C30000 -range 64K -target_address_space [get_bd_addr_spaces processing_system7_0/Data] [get_bd_addr_segs MIPI_CSI_2_RX_A/S_AXI_LITE/S_AXI_LITE_reg]
assign_bd_address -offset 0x43C40000 -range 64K -target_address_space [get_bd_addr_spaces processing_system7_0/Data] [get_bd_addr_segs AXI_GammaCorrection_A/AXI_Lite_Reg_Intf/Reg]
assign_bd_address -offset 0x43C50000 -range 64K -target_address_space [get_bd_addr_spaces processing_system7_0/Data] [get_bd_addr_segs incrust_0/s_axi_AXILiteS/Reg]
assign_bd_address -offset 0x43C80000 -range 64K -target_address_space [get_bd_addr_spaces processing_system7_0/Data] [get_bd_addr_segs video_scaler_a/s_axi_ctrl/Reg]
assign_bd_address -offset 0x43D80000 -range 64K -target_address_space [get_bd_addr_spaces processing_system7_0/Data] [get_bd_addr_segs MIPI_CSI_2_RX_B/S_AXI_LITE/S_AXI_LITE_reg]
assign_bd_address -offset 0x43DB0000 -range 64K -target_address_space [get_bd_addr_spaces processing_system7_0/Data] [get_bd_addr_segs MIPI_D_PHY_RX_B/S_AXI_LITE/S_AXI_LITE_reg]

validate_bd_design
save_bd_design
